# EAGLE design Ai_Cricket (EAGLE 7.1.0)
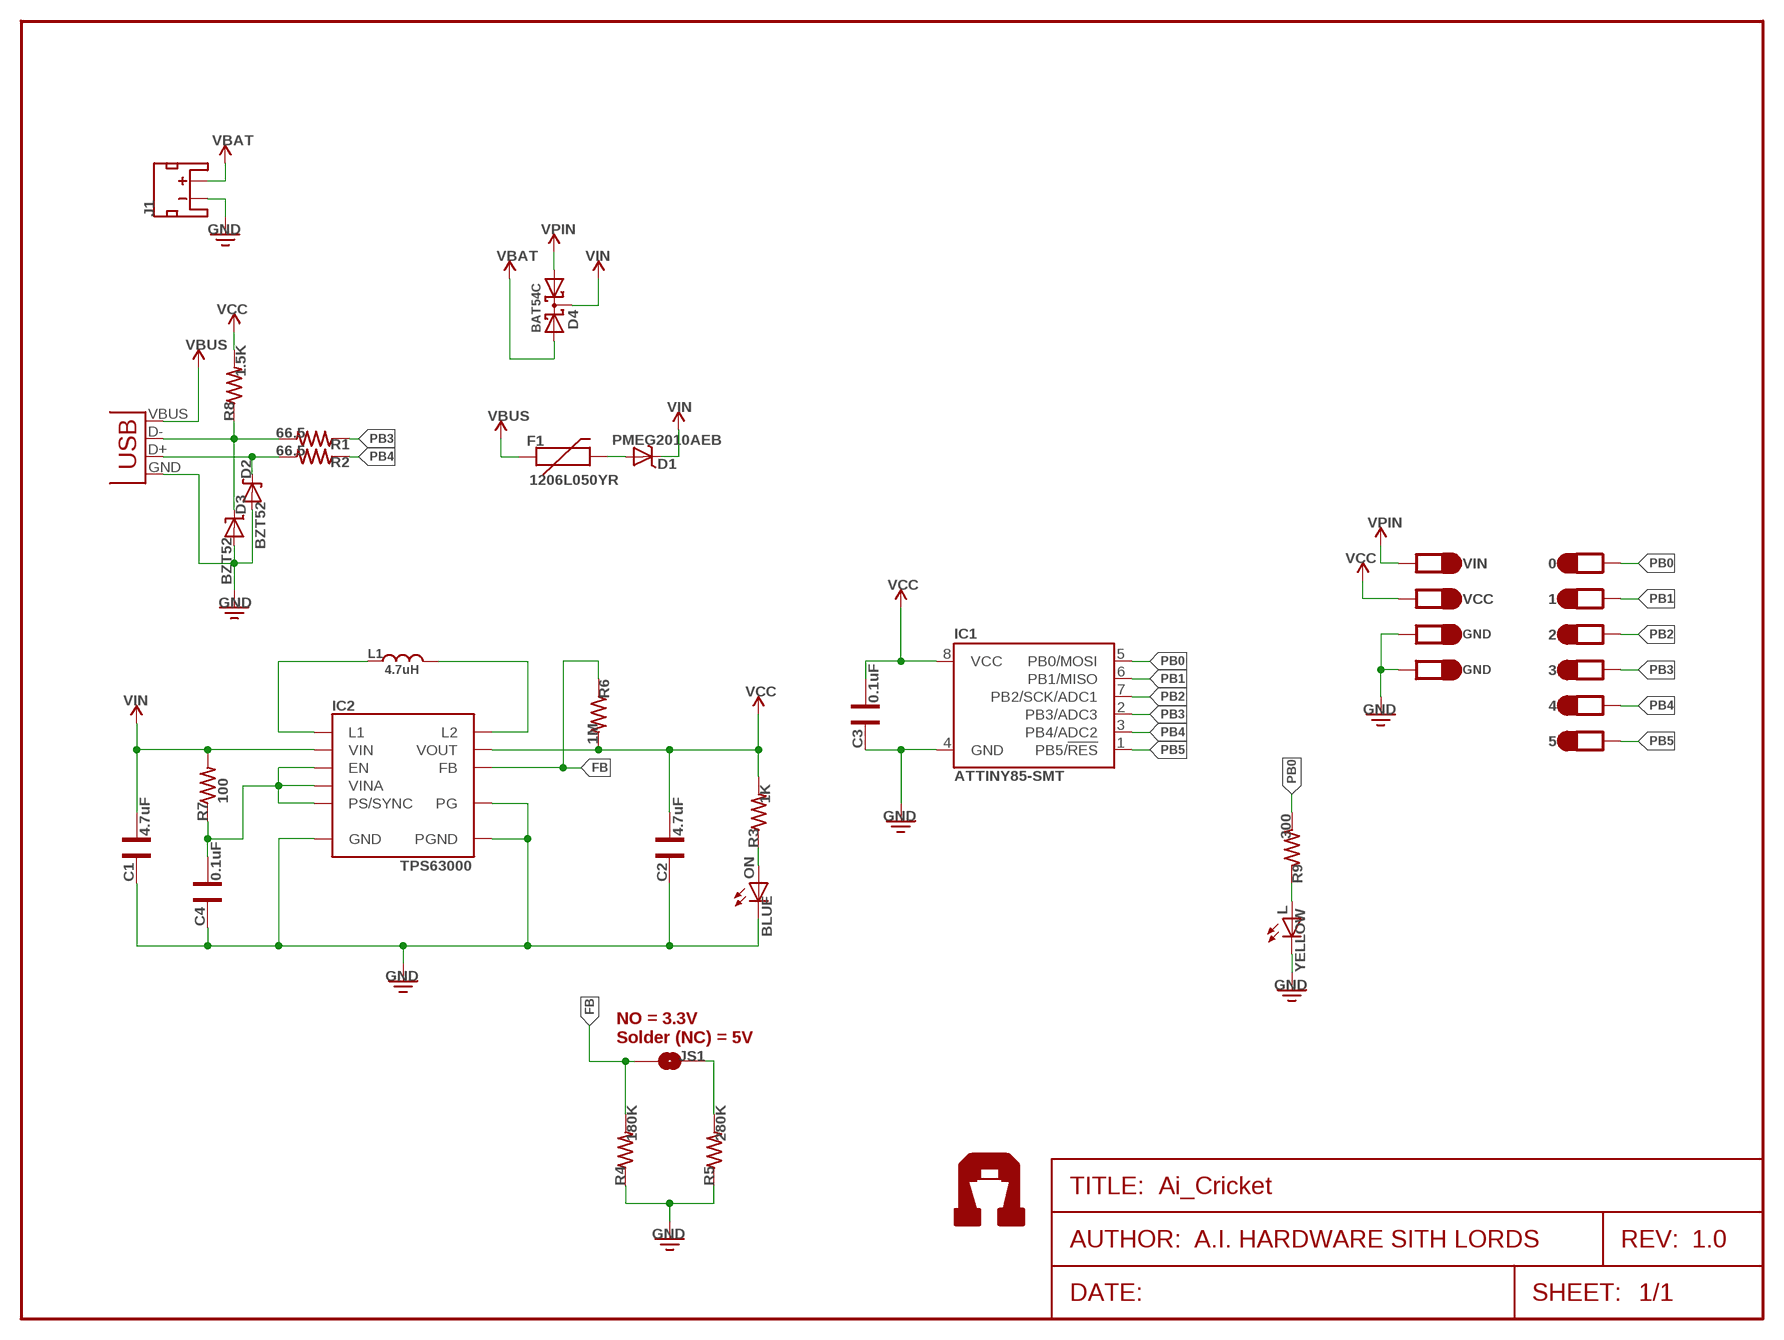
[diagram p0: schematic, sheet 1]
FRAME1 (FRAME-LETTER): AUTHOR: A.I. HARDWARE SITH LORDS; REV: 1.0

## Parts
0  1X01-PETAL  [1X01-PETAL]
1  1X01-PETAL  [1X01-PETAL]
2  1X01-PETAL  [1X01-PETAL]
3  1X01-PETAL  [1X01-PETAL]
4  1X01-PETAL  [1X01-PETAL]
5  1X01-PETAL  [1X01-PETAL]
C1  4.7uF  CAP0402  [CAP-0402]
C2  4.7uF  CAP0402  [CAP-0402]
C3  0.1uF  CAP0402  [CAP-0402]
C4  0.1uF  CAP0402  [CAP-0402]
D1  PMEG2010AEB  DIODE-SCHOTTKYSOD-523  [SOD-523]
D2  BZT52  DIODE-ZENER-BZT52  [SOD-323]
D3  BZT52  DIODE-ZENER-BZT52  [SOD-323]
D4  BAT54C  [SOT-23]
F1  1206L050YR  PTCSMD  [PTC-1206]
GND7  1X01-PETAL  [1X01-PETAL]
GND8  1X01-PETAL  [1X01-PETAL]
IC1  ATTINY85-SMT  [S008-EIAJ]
IC2  TPS63000  [10-VFDFN]
J1  JST-2-MALE  [JST-2-SMD]
JS1  1X02-SJ-NO  [1X02-SJ-NO]
L  YELLOW  LED0603  [LED-0603]
L1  4.7uH  IND0603  [IND-0603]
ON  BLUE  LED0603  [LED-0603]
R1  66.5  RES0402  [RES-0402]
R2  66.5  RES0402  [RES-0402]
R3  1K  RES0402  [RES-0402]
R4  180K  RES0402  [RES-0402]
R5  280K  RES0402  [RES-0402]
R6  1M  RES0402  [RES-0402]
R7  100  RES0402  [RES-0402]
R8  1.5K  RES0402  [RES-0402]
R9  300  RES0402  [RES-0402]
U$14  AI-LOGOXS  [AI-LOGO-XS]
USB1  USBMICROB-TH  [USB-MICROB-TH]
VCC  1X01-PETAL  [1X01-PETAL]
VIN  1X01-PETAL  [1X01-PETAL]

## Nets
FB: IC2.10(FB) JS1.1 R4.2 R6.1
GND [pwr]: C1.2 C2.2 C3.2 C4.2 D2.A D3.A GND7.1 GND8.1 IC1.4(GND) IC2.3(PGND) IC2.9(GND) IC2.P$1(PG) IC2.P$2(PG) IC2.P$3(PG) IC2.P$4(PG) IC2.P$5(PG) J1.2(-) L.C ON.C R4.1 R5.1 USB1.GND
N$1: L.A R9.1
N$3: IC2.4(L1) L1.2
N$4: ON.A R3.1
N$5: IC2.2(L2) L1.1
N$6 [pwr]: D1.A F1.2
N$7: JS1.2 R5.2
N$8: C4.1 IC2.6(EN) IC2.7(PS/SYNC) IC2.8(VINA) R7.1
N$10: D3.C R1.2 R8.1 USB1.D-
N$11: D2.C R2.2 USB1.D+
PB0: 0.1 IC1.5(PB0/MOSI) R9.2
PB1: 1.1 IC1.6(PB1/MISO)
PB2: 2.1 IC1.7(PB2/SCK/ADC1)
PB3: 3.1 IC1.2(PB3/ADC3) R1.1
PB4: 4.1 IC1.3(PB4/ADC2) R2.1
PB5: 5.1 IC1.1(PB5/!RES)
VBAT [pwr]: D4.2(A2) J1.1(+)
VBUS [pwr]: F1.1 USB1.VBUS
VCC [pwr]: C2.1 C3.1 IC1.8(VCC) IC2.1(VOUT) R3.2 R6.2 R8.2 VCC.1
VIN [pwr]: C1.1 D1.C D4.3(CC) IC2.5(VIN) R7.2
VPIN [pwr]: D4.1(A1) VIN.1

## Notes on the sheet
- GND
- GND
- NO = 3.3V
  Solder (NC) = 5V

## Library data of the parts
0 1-5 GND7 GND8 VCC VIN = Ai_Connectors:1X01-PETAL
C1-C4 = Ai_Passives:CAP
D1 = Ai_DiscreteSemis:DIODE-SCHOTTKY: Commonly MBRA140.
D2 D3 = Ai_DiscreteSemis:DIODE-ZENER
D4 = Ai_DiscreteSemis:BAT54C: Schottky Diodes Source: Fairchild .. BAT54.pdf
F1 = Ai_Passives:PTC
IC1 = Ai_IC:ATTINY: Atmel's 8-pin 2/4/8kB flash family of microcontrollers
IC2 = Ai_Power:TPS63000
J1 = Ai_Connectors:JST-2-MALE
JS1 = Ai_Connectors:1X02-SJ-NO: Solder Jumper SMD solder jumper: Normally Open and Normally Closed are the same, but have different paste layers. NC will have a large amount of paste and should jumper during reflow.
L ON = Ai_LED:LED
L1 = Ai_Passives:IND
R1-R9 = Ai_Passives:RES: Part # blah Digikey
U$14 = Ai_Miscellany:AI-LOGO
USB1 = Ai_Connectors:USB

## Net classes
0 default: width 0.203 mm, clearance 0.152 mm
1 pwr: width 0.254 mm, clearance 0.152 mm

## Board
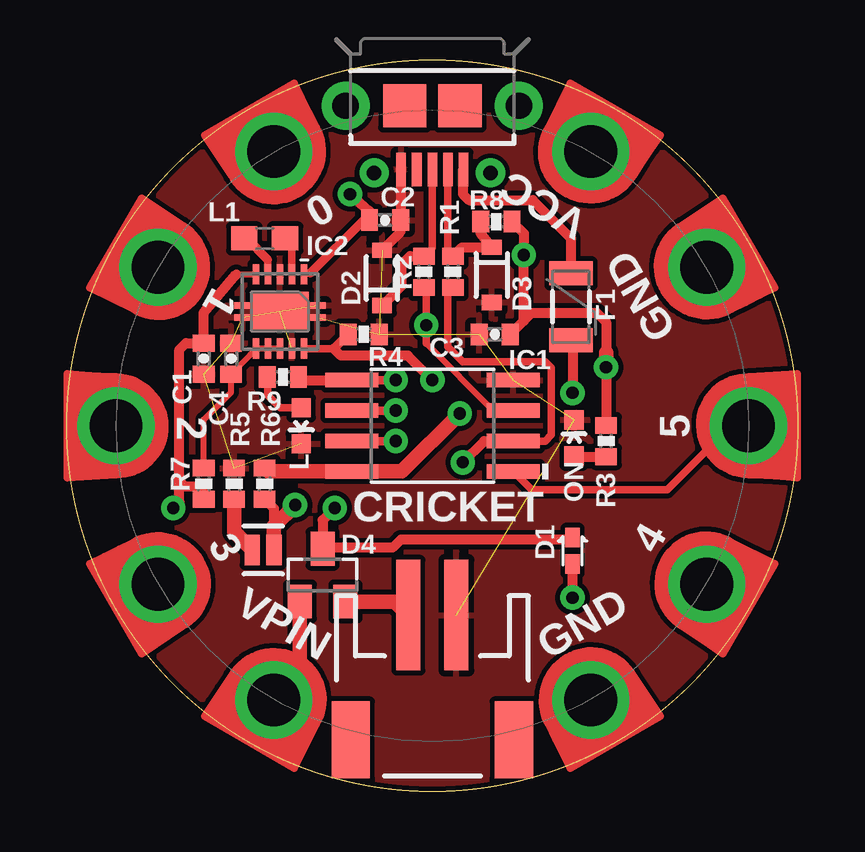
[diagram p1: board, top side]
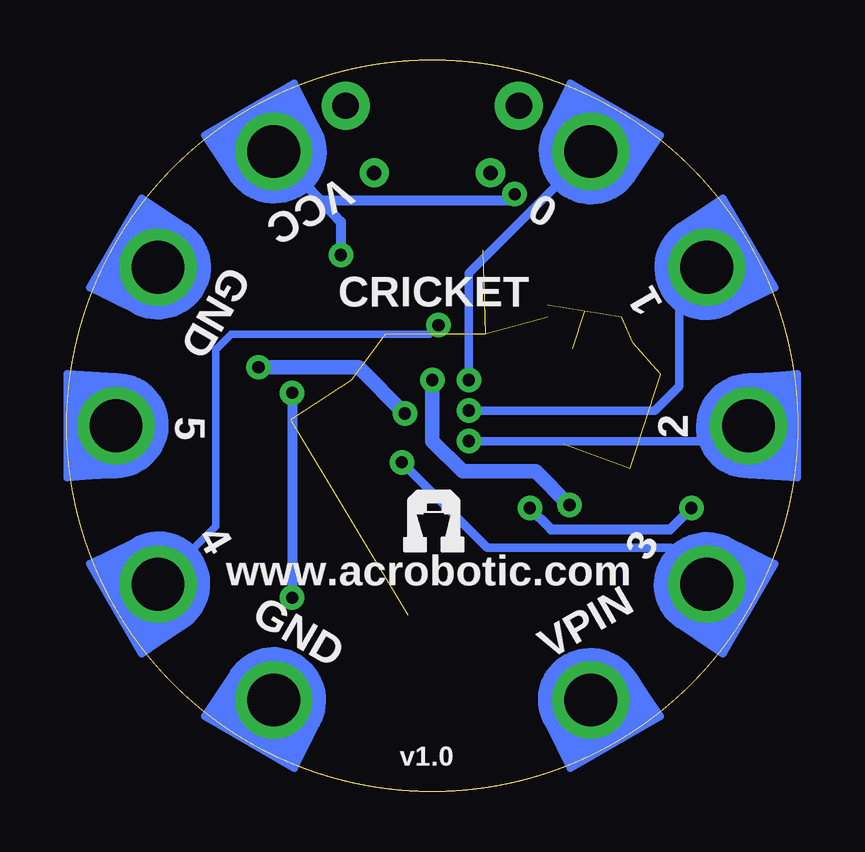
[diagram p2: board, bottom side, seen from below]

Size 30.48 x 30.48 mm. Coordinates in mm from the lower left corner, seen from the top.
Outline: circle at 15.24,15.24 radius 15.24
Copper layers (1*16): Top 0.035mm / dielectric 1.5mm / Bottom 0.035mm
Design rules "ai_2layer": minimum track width 7mil, minimum drill 15mil, track to track 8mil, track to pad 8mil, pad to pad 8mil, via to via 8mil, smd to smd 8mil, copper to edge 8mil, drill to drill 8mil, minimum pad ring 12mil, minimum via ring 10mil, stop-mask expansion 4mil, vias tented up to drill 20mil, thermal gap 10mil

### Footprints (pad centres in the part's own frame; a part is rotated, then mirrored left to right if it is on the bottom)
1X01-PETAL = drill 2.2: 1 0,0
CAP-0402 = smd 0.7 x 0.9: 1 -0.65,0; 2 0.65,0
SOD-523 = smd 0.8 x 0.6: A -0.55,0; C 0.55,0
SOD-323 = smd 0.63 x 0.83: A -1.15,0; C 1.15,0
SOT-23 = smd 1 x 1.4: 1 -0.95,-1.1; 2 0.95,-1.1; 3 0,1.1
PTC-1206 = smd 1 x 1.8: 1 -1.4,0; 2 1.4,0
S008-EIAJ = smd 0.61 x 2.21: 1 -1.905,-3.378; 2 -0.635,-3.378; 3 0.635,-3.378; 4 1.905,-3.378; 5 1.905,3.353; 6 0.635,3.353; 7 -0.635,3.353; 8 -1.905,3.353
10-VFDFN = smd 0.85 x 0.28: 1 -1.55,1; 2 -1.55,0.5; 3 -1.55,0; 4 -1.55,-0.5; 5 -1.55,-1; 6 1.55,-1; 7 1.55,-0.5; 8 1.55,0; 9 1.55,0.5; 10 1.55,1 | smd 1.65 x 2.4: P$1 0,0 | smd 0.28 x 0.7: P$2 -0.25,1.55; P$3 0.25,1.55; P$4 -0.25,-1.55; P$5 0.25,-1.55
JST-2-SMD = smd 1 x 4.6: 1 1,-3.7; 2 -1,-3.7 | smd 1.6 x 3.2: NC1 -3.4,1.5; NC2 3.4,1.5
1X02-SJ-NO = smd 0.635 x 1.27: 1 -0.45,0; 2 0.45,0
LED-0603 = smd 0.8 x 0.8: A 0,-0.75; C 0,0.75
IND-0603 = smd 1.1 x 1: 1 -0.85,0; 2 0.85,0
RES-0402 = smd 0.7 x 0.9: 1 -0.65,0; 2 0.65,0
USB-MICROB-TH = smd 0.4 x 1.4: D+ 0,2.65; D- -0.65,2.65; GND 1.3,2.65; ID 0.65,2.65; VBUS -1.3,2.65 | smd 1.8 x 1.8: M5 -1.15,0; M6 1.15,0 | drill 0.6 pad 1.2: MT1 -2.425,2.8; MT2 2.425,2.8 | drill 1.1 pad 2: MT3 -3.61,0; MT4 3.61,0

### Placement (x,y rotation side)
0  8.64,26.67 30 top
1  3.81,21.84 60 top
2  2.06,15.24 90 top
3  3.81,8.64 120 top
4  26.67,8.64 240 top
5  28.42,15.24 270 top
C1  5.71,18.03 270 top
C2  13.27,23.81 0 top
C3  17.84,19.05 180 top
C4  6.86,18.03 90 top
D1  21.08,10.03 90 top
D2  13.14,21.4 270 top
D3  17.72,21.53 90 top
D4  10.67,9.02 0 top
F1  21.02,20.19 270 top
GND7  26.67,21.84 300 top
GND8  21.84,3.81 210 top
IC1  15.24,15.24 90 top
IC2  8.89,20 270 top
J1  15.24,3.65 180 top
JS1  8.19,10.06 180 top
L  9.78,15.24 180 top
L1  8.26,23.05 180 top
ON  21.15,14.73 0 top
R1  16.1,21.65 90 top
R2  14.89,21.65 90 top
R3  22.48,14.61 90 top
R4  12.38,19.05 180 top
R5  6.99,12.83 270 top
R6  8.26,12.83 90 top
R7  5.71,12.83 270 top
R8  17.91,23.75 0 top
R9  9.02,17.27 0 top
U$14  16.51,9.91 0 bottom
USB1  15.24,28.57 180 top
VCC  21.84,26.67 330 top
VIN  8.64,3.81 150 top

### Tracks (layer width: path | path; a pad name or v marks a point on that pad's centre or on a via)
FB  (via drill 0.51)
  Top 0.305: 11.13,18.45 IC2.10
  Top 0.356: R4.2 11.13,18.45
  Top 0.406: v15.24,17.14 14.22,18.16 11.43,18.16 11.13,18.45 | R6.1 8.64,11.8 JS1.1
  Top 0.61: JS1.1 8.64,11.05 v9.53,11.94
  Bottom 0.61: v9.53,11.94 10.92,13.34 13.97,13.34 15.24,14.61 v15.24,17.14
GND  (13 unrouted)
  Top 0.406: D2.A 13.92,23.33 C2.2 13.92,25.91 USB1.GND
  pour Bottom: 0,0 0,30.48 30.48,30.48 30.48,0
  pour Top: 0,0 0,30.48 30.48,30.48 30.48,0
N$1
  Top 0.254: 8.38,17.13 R9.1
  Top 0.305: L.A 8.9,15.99 8.38,16.51 8.38,17.13
N$3
  Top 0.305: IC2.4 8.39,22.17
  Top 0.356: 8.39,22.17 7.51,23.05
  Top 0.406: 7.51,23.05 L1.2
N$4
  Top 0.406: ON.A 21.17,13.96 R3.1
N$5
  Top 0.305: IC2.2 9.39,22.77
  Top 0.356: 9.39,22.77 L1.1
N$6  (via drill 0.51)
  Top 0.406: F1.2 21.08,18.6 v21.08,16.61 | v21.08,8.08 D1.A
  Bottom 0.406: v21.08,16.61 v21.08,8.08
N$7
  Top 0.61: JS1.2 6.99,10.82 R5.2
N$8
  Top 0.254: IC2.8 IC2.7 IC2.6 C4.1 6.86,16.64 5.71,15.49 R7.1
N$10
  Top 0.254: R1.2 15.89,22.51
  Top 0.305: 15.89,22.51 USB1.D-
  Top 0.406: R8.1 17.26,23.26 D3.C 16.47,22.68 R1.2
N$11
  Top 0.254: R2.2 15.24,22.65
  Top 0.305: 15.24,22.65 USB1.D+
  Top 0.406: D2.C 13.97,21.07 13.97,21.97 14.3,22.3 R2.2
PB0  (via drill 0.51)
  Top 0.356: IC1.5 v13.72,17.14
  Top 0.406: R9.2 9.79,17.14 IC1.5
  Bottom 0.356: v13.72,17.14 13.72,21.59 0.1
PB1  (via drill 0.51)
  Top 0.356: IC1.6 v13.72,15.88
  Bottom 0.356: v13.72,15.88 5.97,15.88 4.95,16.89 4.95,20.7 1.1
PB2  (via drill 0.51)
  Top 0.356: IC1.7 v13.72,14.61
  Bottom 0.356: v13.72,14.61 2.7,14.61 2.1
PB3  (via drill 0.51)
  Top 0.254: R1.1 15.88,20.78
  Top 0.305: 15.88,20.78 15.88,18.54 16.51,17.91 19.94,17.91 20.19,17.65 20.19,14.86 19.94,14.61 IC1.2
  Top 0.406: v16.51,13.72 17.4,14.61 IC1.2
  Bottom 0.356: v16.51,13.72 12.95,10.16 5.33,10.16 3.1
PB4  (via drill 0.51)
  Top 0.254: R2.1 14.99,20.91 | 14.99,18.67 17.78,15.88 IC1.3
  Top 0.305: 14.99,18.67 v14.99,19.43 14.99,20.91
  Bottom 0.305: v14.99,19.43 15.37,19.05 23.62,19.05 24.26,18.41 24.26,11.05 4.1
PB5
  Top 0.254: 27.69,15.24 5.1
  Top 0.305: IC1.1 19.38,12.57 25.02,12.57 27.69,15.24
VBAT
  Top 0.61: J1.1 13.67,7.92 D4.2
VBUS
  Top 0.406: USB1.VBUS 16.51,25.89 16.51,24.89 16.76,24.64 19.43,24.64 21.02,23.05 F1.1
VCC  (via drill 0.51)
  Top 0.254: IC2.1 9.93,21.59 10.16,21.59
  Top 0.356: 10.16,21.59 12.38,23.81 C2.1
  Top 0.406: R8.2 19.05,23.26 v19.05,22.35 19.05,19.61 | 22.48,18.29 22.48,19.56 22.1,19.94 19.38,19.94 19.05,19.61 | v22.48,17.68 R3.2 | C3.1 19.05,19.61 | C2.1 12.62,24.18 v11.81,24.89
  Top 0.61: v22.48,17.68 22.48,18.29 | v16.38,15.75 13.97,13.34 IC1.8 8.4,13.34 R6.2
  Bottom 0.406: VCC.1 20.04,24.79 | 20.04,24.79 19.05,23.75 v19.05,22.35 | 20.04,24.79 19.89,24.64 12.06,24.64 v11.81,24.89
  Bottom 0.61: v22.48,17.68 18.31,17.68 v16.38,15.75
VIN  (via drill 0.51)
  Top 0.254: 7.07,21.55 IC2.5 | D1.C 21,10.5
  Top 0.406: 4.7,12.95 4.7,18.41 4.97,18.68 C1.1 5.71,19.94 7.07,21.55 | v11.18,11.81 10.67,11.3 D4.3 11.01,10.16 13.59,10.16 13.93,10.5 21,10.5 | R7.2 5.71,12.7 4.95,12.7 4.7,12.95 | v4.45,11.81 4.7,12.06 4.7,12.95
  Bottom 0.406: v11.18,11.81 10.29,10.92 5.33,10.92 v4.45,11.81
VPIN
  Top 0.61: VIN.1 8.57,3.87 9.72,5.01 D4.1

### Text on the board
tPlace: 0 | VCC | 1 | GND | 2 | 5 | CRICKET | 3 | 4 | VPIN | GND
bPlace: VCC | 0 | GND | 1 | CRICKET | 5 | 2 | 4 | 3 | www.acrobotic.com | GND | VPIN | v1.0